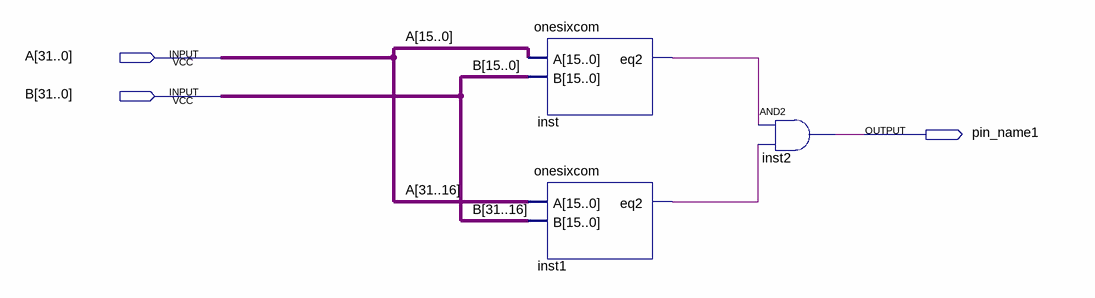
[diagram p0: schematic sheet]
// Quartus schematic threetwocom.bdf as structural Verilog: 3 symbols, 3 pins
module threetwocom (
  input  [31:0] A,
  input  [31:0] B,
  output pin_name1
);

  wire inst1_eq2, inst_eq2;

  onesixcom inst (.A(A[15:0]), .B(B[15:0]), .eq2(inst_eq2));
  onesixcom inst1 (.A(A[31:16]), .B(B[31:16]), .eq2(inst1_eq2));
  and inst2 (pin_name1, inst_eq2, inst1_eq2);
endmodule
